# Altium schematic sheet Kontroler.SchDoc
size A2; SheetNumber: 1; SheetTotal: 1
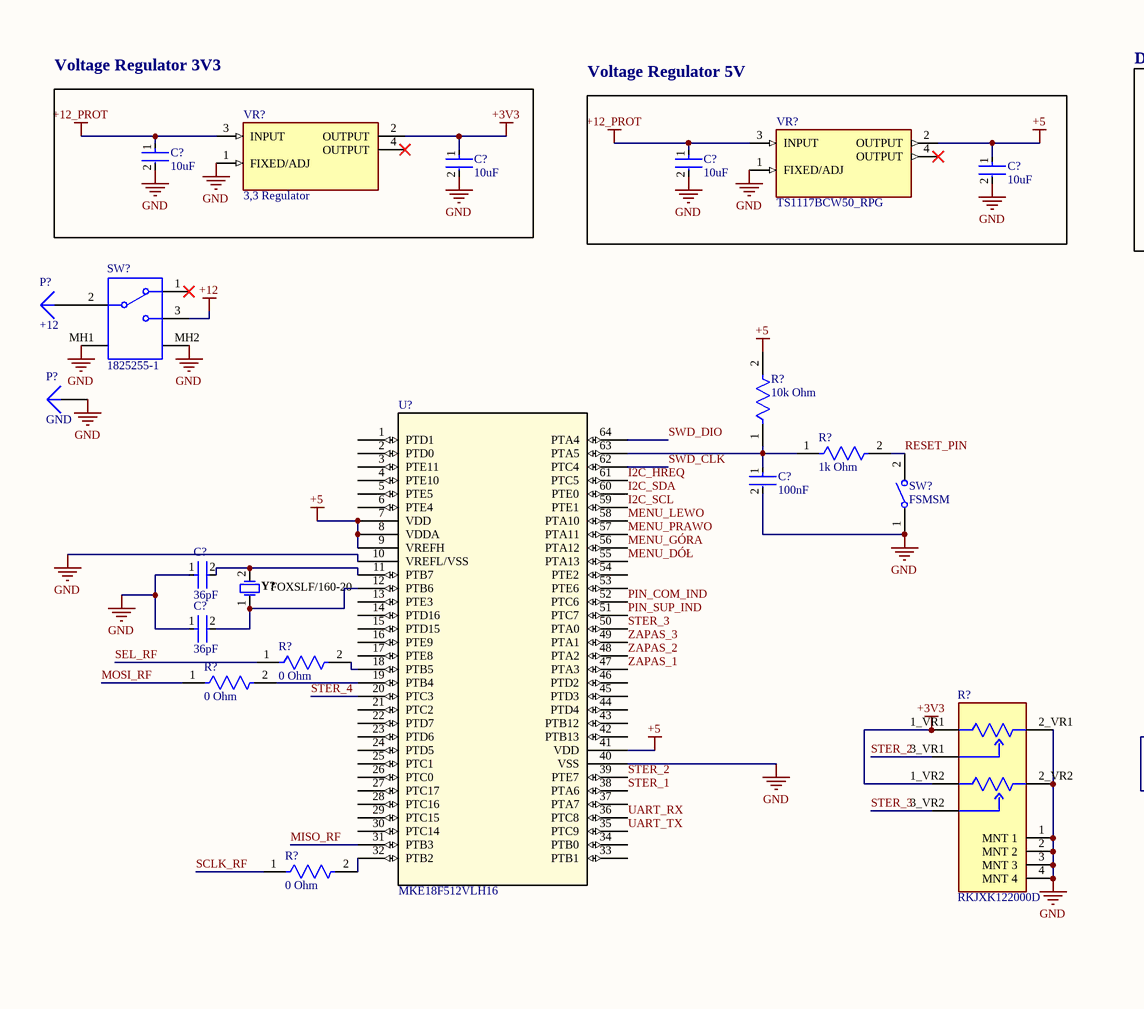
[diagram p0: Kontroler.SchDoc, left]
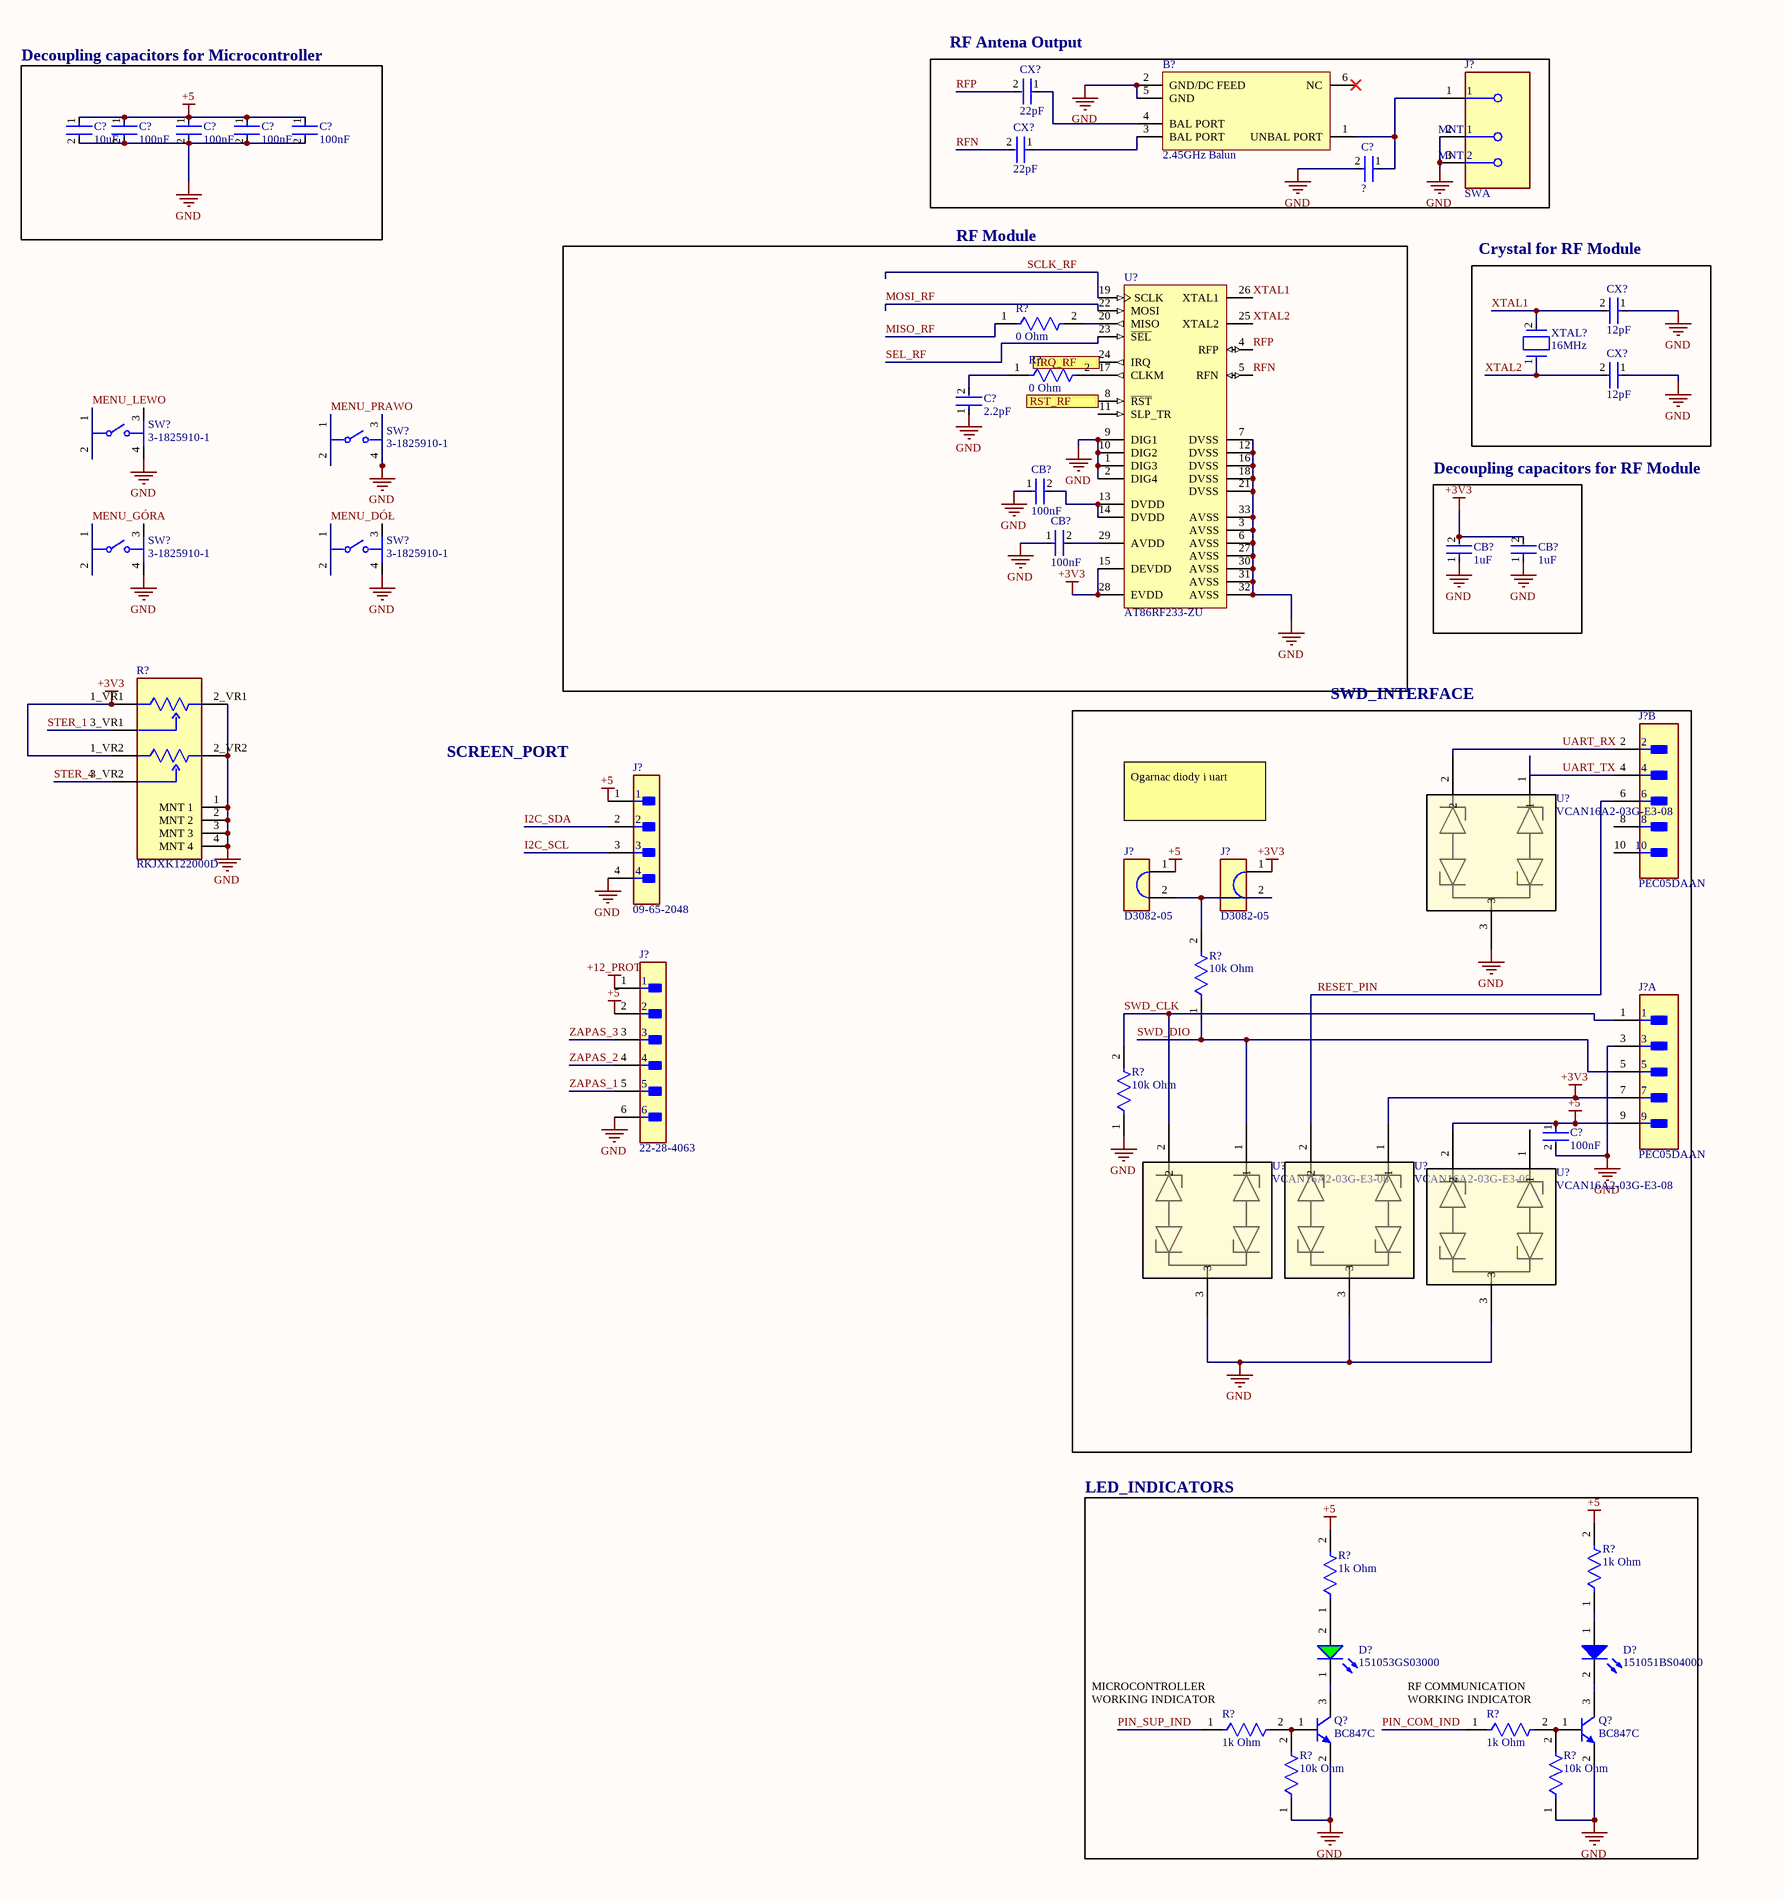
[diagram p1: Kontroler.SchDoc, right]

## Parts
(Parts that share a designator on the sheet are numbered #1, #2 ... from top to bottom, then left to right.)
B?  2.45GHz Balun  [WE-BAL_0805]
C?#1  10uF  [FP-CC0805-0_85-MFG]
C?#2  100nF  [FP-CC0805-0_85-MFG]
C?#3  100nF  [FP-CC0805-0_85-MFG]
C?#4  100nF  [FP-CC0805-0_85-MFG]
C?#5  100nF  [FP-CC0805-0_85-MFG]
C?#6  10uF  [FP-CC0805-0_85-MFG]
C?#7  10uF  [FP-CC0805-0_85-MFG]
C?#8  10uF  [FP-CC0805-0_85-MFG]
C?#9  10uF  [FP-CC0805-0_85-MFG]
C?#10  ?  [FP-CC0805-0_85-MFG]
C?#11  2.2pF  [FP-CC0805-0_85-MFG]
C?#12  100nF  [FP-CC0805-0_85-MFG]
C?#13  36pF  [FP-CC0805-0_85-MFG]
C?#14  36pF  [FP-CC0805-0_85-MFG]
C?#15  100nF  [FP-CC0805-0_85-MFG]
CB?#1  100nF  [FP-CC0805-0_85-MFG]
CB?#2  100nF  [FP-CC0805-0_85-MFG]
CB?#3  1uF  [FP-CC0805-0_85-MFG]
CB?#4  1uF  [FP-CC0805-0_85-MFG]
CX?#1  22pF  [FP-CC0805-0_85-MFG]
CX?#2  22pF  [FP-CC0805-0_85-MFG]
CX?#3  12pF  [FP-CC0805-0_85-MFG]
CX?#4  12pF  [FP-CC0805-0_85-MFG]
D?#1  151053GS03000  [WL-TMRW_D5.8H11.7]
D?#2  151051BS04000  [WL-TMRC_D5.9H8.7]
J?#1  SWA  [FP-142-0701-801-MFG]
J?#2  PEC05DAAN  [FP-PEC05DAAN-MFG]  (part B of 2)
J?#3  09-65-2048  [FP-09-65-2048-MFG]
J?#4  D3082-05  [FP-D3082-05-MFG]
J?#5  D3082-05  [FP-D3082-05-MFG]
J?#6  22-28-4063  [FP-22-28-4063-MFG]
J?#7  PEC05DAAN  [FP-PEC05DAAN-MFG]  (part A of 2)
P?#1  +12  [PIN1]
P?#2  GND  [PIN1]
Q?#1  BC847C  [INF-SOT23_L]
Q?#2  BC847C  [INF-SOT23_L]
R?#1  0 Ohm  [FP-RMCF0805-MFG]
R?#2  0 Ohm  [FP-RMCF0805-MFG]
R?#3  10k Ohm  [FP-RMCF0805-MFG]
R?#4  1k Ohm  [FP-RMCF0805-MFG]
R?#5  0 Ohm  [FP-RMCF0805-MFG]
R?#6  0 Ohm  [FP-RMCF0805-MFG]
R?#7  RKJXK122000D  [FP-RKJXK122000D-MFG]
R?#8  RKJXK122000D  [FP-RKJXK122000D-MFG]
R?#9  0 Ohm  [FP-RMCF0805-MFG]
R?#10  10k Ohm  [FP-RMCF0805-MFG]
R?#11  10k Ohm  [FP-RMCF0805-MFG]
R?#12  1k Ohm  [FP-RMCF0805-MFG]
R?#13  1k Ohm  [FP-RMCF0805-MFG]
R?#14  1k Ohm  [FP-RMCF0805-MFG]
R?#15  1k Ohm  [FP-RMCF0805-MFG]
R?#16  10k Ohm  [FP-RMCF0805-MFG]
R?#17  10k Ohm  [FP-RMCF0805-MFG]
SW?#1  1825255-1  [TECO-1825255-1_V]
SW?#2  3-1825910-1  [FP-3-1825910-1-MFG]
SW?#3  3-1825910-1  [FP-3-1825910-1-MFG]
SW?#4  FSMSM  [TECO-FSMSM-2_V]
SW?#5  3-1825910-1  [FP-3-1825910-1-MFG]
SW?#6  3-1825910-1  [FP-3-1825910-1-MFG]
U?#1  AT86RF233-ZU  [32QN2_M]
U?#2  MKE18F512VLH16  [LQFP64-10x10_NXP]
U?#3  VCAN16A2-03G-E3-08  [SOT_3G-E3-08_VIS]
U?#4  VCAN16A2-03G-E3-08  [SOT_3G-E3-08_VIS]
U?#5  VCAN16A2-03G-E3-08  [SOT_3G-E3-08_VIS]
U?#6  VCAN16A2-03G-E3-08  [SOT_3G-E3-08_VIS]
VR?#1  3,3 Regulator  [VREG_TS1117BCW33_RPG]
VR?#2  TS1117BCW50_RPG  [VREG_TS1117BCW50_RPG]
XTAL?  16MHz  [FP-ABLS-MFG]
Y?  FOXSLF/160-20  [FOX-FOXSLF160-20]

## Blocks framed on the sheet
Decoupling capacitors for Microcontroller: C?#1-C?#5
RF Module: C?#11 CB?#1 CB?#2 R?#1 R?#2 U?#1
Crystal for RF Module: CX?#3 CX?#4 XTAL?
Decoupling capacitors for RF Module: CB?#3 CB?#4
SWD_INTERFACE: C?#15 J?#2 J?#4 J?#5 J?#7 R?#10 R?#11 U?#3-U?#6
LED_INDICATORS: D?#1 D?#2 Q?#1 Q?#2 R?#12-R?#17

## Ports
IRQ_RF (out), RST_RF (in)

## Nets
+3V3: C?#7.1 CB?#3.2 CB?#4.2 J?#5.1 J?#7.7 R?#7.1_VR1(1_VR1) R?#7.1_VR2(1_VR2) R?#8.1_VR1(1_VR1) R?#8.1_VR2(1_VR2) U?#1.15(DEVDD) U?#1.28(EVDD) U?#5.1 VR?#1.2(OUTPUT)
+5: C?#1.1 C?#2.1 C?#3.1 C?#4.1 C?#5.1 C?#9.1 C?#15.1 J?#3.1 J?#4.1 J?#6.2 J?#7.9 R?#3.2 R?#12.2 R?#13.2 U?#2.7(VDD) U?#2.8(VDDA) U?#2.9(VREFH) U?#2.41(VDD) U?#6.2 VR?#2.2(OUTPUT)
+12: SW?#1.3
+12_PROT: C?#6.1 C?#8.1 J?#6.1 VR?#1.3(INPUT) VR?#2.3(INPUT)
GND: B?.2(GND/DC_FEED) B?.5(GND) C?#1.2 C?#2.2 C?#3.2 C?#4.2 C?#5.2 C?#6.2 C?#7.2 C?#8.2 C?#9.2 C?#10.2 C?#11.1 C?#12.2 C?#13.1 C?#14.1 C?#15.2 CB?#1.1 CB?#2.1 CB?#3.1 CB?#4.1 CX?#3.1 CX?#4.1 J?#1.2(MNT_1) J?#1.3(MNT_2) J?#3.4 J?#6.6 J?#7.3 P?#2.1 Q?#1.2(E) Q?#2.2(E) R?#7.1(MNT_1) R?#7.2(MNT_2) R?#7.2_VR1(2_VR1) R?#7.2_VR2(2_VR2) R?#7.3(MNT_3) R?#7.4(MNT_4) R?#8.1(MNT_1) R?#8.2(MNT_2) R?#8.2_VR1(2_VR1) R?#8.2_VR2(2_VR2) R?#8.3(MNT_3) R?#8.4(MNT_4) R?#11.1 R?#16.1 R?#17.1 SW?#1.MH1 SW?#1.MH2 SW?#2.4 SW?#3.3 SW?#3.4 SW?#4.1 SW?#5.4 SW?#6.4 U?#1.1(DIG3) U?#1.2(DIG4) U?#1.3(AVSS) U?#1.6(AVSS) U?#1.7(DVSS) U?#1.9(DIG1) U?#1.10(DIG2) U?#1.12(DVSS) U?#1.16(DVSS) U?#1.18(DVSS) U?#1.21(DVSS) U?#1.27(AVSS) U?#1.30(AVSS) U?#1.31(AVSS) U?#1.32(AVSS) U?#1.33(AVSS) U?#2.10(VREFL/VSS) U?#2.40(VSS) U?#3.3 U?#4.3 U?#5.3 U?#6.3 VR?#1.1(FIXED/ADJ) VR?#2.1(FIXED/ADJ)
I2C_HREQ: U?#2.61(PTC5)
I2C_SCL: J?#3.3 U?#2.59(PTE1)
I2C_SDA: J?#3.2 U?#2.60(PTE0)
MENU_DÓŁ: SW?#6.1 SW?#6.2 U?#2.55(PTA13)
MENU_GÓRA: SW?#5.1 SW?#5.2 U?#2.56(PTA12)
MENU_LEWO: SW?#2.1 SW?#2.2 U?#2.58(PTA10)
MENU_PRAWO: SW?#3.1 SW?#3.2 U?#2.57(PTA11)
MISO_RF: R?#1.1 U?#2.31(PTB3)
MOSI_RF: R?#6.1 U?#1.22(MOSI)
PIN_COM_IND: R?#15.1 U?#2.52(PTC6)
PIN_SUP_IND: R?#14.1 U?#2.51(PTC7)
RESET_PIN: J?#2.6 R?#4.2 SW?#4.2 U?#5.2
RFN: CX?#2.2 U?#1.5(RFN)
RFP: CX?#1.2 U?#1.4(RFP)
RST_RF: U?#1.8(~{RST}) ; port RST_RF
SCLK_RF: R?#9.1 U?#1.19(SCLK)
SEL_RF: R?#5.1 U?#1.23(~{SEL})
STER_1: R?#8.3_VR1(3_VR1) U?#2.38(PTA6)
STER_2: R?#7.3_VR1(3_VR1) U?#2.39(PTE7)
STER_3: R?#7.3_VR2(3_VR2) U?#2.50(PTA0)
STER_4: R?#8.3_VR2(3_VR2) U?#2.20(PTC3)
SWD_CLK: J?#7.1 R?#11.2 U?#2.62(PTC4) U?#4.2
SWD_DIO: J?#7.5 R?#10.1 U?#2.64(PTA4) U?#4.1
UART_RX: J?#2.2 U?#2.36(PTC8) U?#3.2
UART_TX: J?#2.4 U?#2.35(PTC9) U?#3.1
XTAL1: CX?#3.2 U?#1.26(XTAL1) XTAL?.2
XTAL2: CX?#4.2 U?#1.25(XTAL2) XTAL?.1
ZAPAS_1: J?#6.5 U?#2.47(PTA3)
ZAPAS_2: J?#6.4 U?#2.48(PTA2)
ZAPAS_3: J?#6.3 U?#2.49(PTA1)
NetB?_1: B?.1(UNBAL_PORT) C?#10.1 J?#1.1
NetB?_3: B?.3(BAL_PORT) CX?#2.1
NetB?_4: B?.4(BAL_PORT) CX?#1.1
NetC?#11_2: C?#11.2 R?#2.1
NetC?#12_1: C?#12.1 R?#3.1 R?#4.1 U?#2.63(PTA5)
NetC?#13_2: C?#13.2 U?#2.11(PTB7) Y?.2
NetC?#14_2: C?#14.2 U?#2.12(PTB6) Y?.1
NetCB?#1_2: CB?#1.2 U?#1.13(DVDD) U?#1.14(DVDD)
NetCB?#2_2: CB?#2.2 U?#1.29(AVDD)
NetD?#1_1: D?#1.1(K) Q?#1.3(C)
NetD?#1_2: D?#1.2(A) R?#13.1
NetD?#2_1: D?#2.1(A) R?#12.1
NetD?#2_2: D?#2.2(K) Q?#2.3(C)
NetJ?#4_2: J?#4.2 J?#5.2 R?#10.2
NetP?#1_1: P?#1.1 SW?#1.2
NetQ?#1_1: Q?#1.1(B) R?#14.2 R?#16.2
NetQ?#2_1: Q?#2.1(B) R?#15.2 R?#17.2
NetR?#1_2: R?#1.2 U?#1.20(MISO)
NetR?#2_2: R?#2.2 U?#1.17(CLKM)
NetR?#5_2: R?#5.2 U?#2.18(PTB5)
NetR?#6_2: R?#6.2 U?#2.19(PTB4)
NetR?#9_2: R?#9.2 U?#2.32(PTB2)

Not connected (* = marked no-connect by the designer): B? 6(NC)*; J?#2 8 10; SW?#1 1*; SW?#2 3; SW?#5 3; SW?#6 3; U?#1 11(SLP_TR) 24(IRQ); U?#2 1(PTD1) 2(PTD0) 3(PTE11) 4(PTE10) 5(PTE5) 6(PTE4) 13(PTE3) 14(PTD16) 15(PTD15) 16(PTE9) 17(PTE8) 21(PTC2) 22(PTD7) 23(PTD6) 24(PTD5) 25(PTC1) 26(PTC0) 27(PTC17) 28(PTC16) 29(PTC15) 30(PTC14) 33(PTB1) 34(PTB0) 37(PTA7) 42(PTB13) 43(PTB12) 44(PTD4) 45(PTD3) 46(PTD2) 53(PTE6) 54(PTE2); U?#6 1; VR?#1 4(OUTPUT)*; VR?#2 4(OUTPUT)*

## Notes on the sheet
- (near CX?#1) RF Antena Output
- Voltage Regulator 3V3
- Voltage Regulator 5V
- SCREEN_PORT
- Ogarnac diody i uart
- (near R?#14) MICROCONTROLLER WORKING INDICATOR
- (near R?#15) RF COMMUNICATION WORKING INDICATOR

## Library data of the parts
B? = CMP-03913-19122360-1: 748421245 100O Surface Mount Chip Balun; Insertion Loss (dB): 0.54dB; Impedance: 100Ω; Frequency: 2.5GHz; Depth: 850µm; Case Code (Metric): 2012; Height: 850µm; Max Operating Temperature: 85°C; Length: 2mm; Width: 1.25mm; Termination: SMD/SMT; Case Code (Imperial): 0805; Number of Pins: 6; RoHS: Compliant; Max Switching Frequency: 2.5GHz; NexarPartId: 19122360; REACH SVHC: Unknown; Case/Package: 0805; Min Operating Temperature: -40°C; Lead Free: Lead Free; Mount: Surface Mount; Max Frequency: 2.5GHz; Packaging: Cut Tape (CT)
C?#1 C?#6-C?#11 C?#13 C?#14 = CMP-2100-03606-3: CAP CER 0.1UF 50V X7R 0805; Manufacturer Part Number: CC0805KRX7R9BB104; Manufacturer: Yageo; Tolerance: 0.1; Capacitance: 100 nF; Value: 100 nF; Material: Ceramic; Device Class L1: Passive Components; ComponentLink2Description: Datasheet; Package: CC0805-0.85; Digikey Description: CAP CER 0.1UF 50V X7R 0805; Device Class L3: Ceramic Capacitors; Temperature: -30°C to +85°C; Temperature Characteristic: X7R; Voltage Rating: 50 V; Height: 0.95mm; RoHS: TRUE; Ipc Land Pattern Name: CAPC200125X85; Device Class L2: Capacitors; Category: Cap; Temperature Range Low: -30°C; Temperature Range High: +85°C; Mouser Description: Multilayer Ceramic Capacitors MLCC - SMD/SMT 100nF 50V X7R 10%; Footprint Url: http://www.yageo.com/exep/pages/download/literatures/UPY-C_GEN_24.pdf; Automotive: No; Octopart: https://octopart.com/cc0805krx7r9bb104-yageo-192993; Lead Free: Yes; ComponentLink2URL: http://www.yageo.com/documents/recent/UPY-GPHC_Y5V_6.3V-to-50V_8.pdf
C?#2-C?#5 C?#12 C?#15 = CMP-2100-03606-3: CAP CER 0.1UF 50V X7R 0805; Manufacturer Part Number: CC0805KRX7R9BB104; Manufacturer: Yageo; Tolerance: 0.1; Material: Ceramic; Device Class L1: Passive Components; ComponentLink2Description: Datasheet; Package: CC0805-0.85; Digikey Description: CAP CER 0.1UF 50V X7R 0805; Capacitance: 100 nF; Device Class L3: Ceramic Capacitors; Value: 100 nF; Temperature: -30°C to +85°C; Temperature Characteristic: X7R; Voltage Rating: 50 V; Height: 0.95mm; RoHS: TRUE; Ipc Land Pattern Name: CAPC200125X85; Device Class L2: Capacitors; Category: Cap; Temperature Range Low: -30°C; Temperature Range High: +85°C; Mouser Description: Multilayer Ceramic Capacitors MLCC - SMD/SMT 100nF 50V X7R 10%; Footprint Url: http://www.yageo.com/exep/pages/download/literatures/UPY-C_GEN_24.pdf; Automotive: No; Octopart: https://octopart.com/cc0805krx7r9bb104-yageo-192993; Lead Free: Yes; ComponentLink2URL: http://www.yageo.com/documents/recent/UPY-GPHC_Y5V_6.3V-to-50V_8.pdf
CB?#1 CB?#2 = CMP-2100-03606-3: CAP CER 0.1UF 50V X7R 0805; Manufacturer Part Number: CC0805KRX7R9BB104; Manufacturer: Yageo; Tolerance: 0.1; Device Class L1: Passive Components; ComponentLink2Description: Datasheet; Package: CC0805-0.85; Digikey Description: CAP CER 0.1UF 50V X7R 0805; Capacitance: 100 nF; Device Class L3: Ceramic Capacitors; Value: 100 nF; Temperature: -30°C to +85°C; Temperature Characteristic: X7R; Voltage Rating: 50 V; Height: 0.95mm; RoHS: TRUE; Ipc Land Pattern Name: CAPC200125X85; Device Class L2: Capacitors; Category: Cap; Temperature Range Low: -30°C; Temperature Range High: +85°C; Material: Ceramic; Mouser Description: Multilayer Ceramic Capacitors MLCC - SMD/SMT 100nF 50V X7R 10%; Footprint Url: http://www.yageo.com/exep/pages/download/literatures/UPY-C_GEN_24.pdf; Automotive: No; Octopart: https://octopart.com/cc0805krx7r9bb104-yageo-192993; Lead Free: Yes; ComponentLink2URL: http://www.yageo.com/documents/recent/UPY-GPHC_Y5V_6.3V-to-50V_8.pdf
CB?#3 CB?#4 CX?#1-CX?#4 = CMP-2100-03606-3: CAP CER 0.1UF 50V X7R 0805; Manufacturer Part Number: CC0805KRX7R9BB104; Manufacturer: Yageo; Tolerance: 0.1; Capacitance: 100 nF; Value: 100 nF; Device Class L1: Passive Components; ComponentLink2Description: Datasheet; Package: CC0805-0.85; Digikey Description: CAP CER 0.1UF 50V X7R 0805; Device Class L3: Ceramic Capacitors; Temperature: -30°C to +85°C; Temperature Characteristic: X7R; Voltage Rating: 50 V; Height: 0.95mm; RoHS: TRUE; Ipc Land Pattern Name: CAPC200125X85; Device Class L2: Capacitors; Category: Cap; Temperature Range Low: -30°C; Temperature Range High: +85°C; Material: Ceramic; Mouser Description: Multilayer Ceramic Capacitors MLCC - SMD/SMT 100nF 50V X7R 10%; Footprint Url: http://www.yageo.com/exep/pages/download/literatures/UPY-C_GEN_24.pdf; Automotive: No; Octopart: https://octopart.com/cc0805krx7r9bb104-yageo-192993; Lead Free: Yes; ComponentLink2URL: http://www.yageo.com/documents/recent/UPY-GPHC_Y5V_6.3V-to-50V_8.pdf
D?#1 = CMP-1489-00005-2: NexarPartId: 29717817; Viewing Angle: 30°; Color: Green; Wavelength: 522nm; Max Reverse Voltage (DC): 5V; Test Current: 20mA; Forward Current: 100mA; Forward Voltage: 3.4V; Lens Style: Circular, Clear, Round; Luminous Intensity: 10cd; Lens Size: 5mm; Peak Wavelength: 515nm; Length: 5mm; Min Operating Temperature: -40°C; Case/Package: Radial; REACH SVHC: Unknown; Height: 8.6mm; Mount: Through Hole; Dominant Wavelength: 522nm; Max Operating Temperature: 85°C; Width: 5mm; Packaging: Bulk; RoHS: Compliant
D?#2 = CMP-1488-00009-2: NexarPartId: 29717812; Test Current: 20mA; Forward Voltage: 3.2V; Wavelength: 470nm; Lens Size: 5mm; Lens Style: Circular, Diffused, Round; Forward Current: 100mA; Peak Wavelength: 465nm; Viewing Angle: 40°; Luminous Intensity: 500mcd; Max Reverse Voltage (DC): 5V; Color: Blue; Case/Package: Radial; Width: 5mm; Mount: Through Hole; Min Operating Temperature: -40°C; Length: 5mm; Height: 8.6mm; Max Operating Temperature: 85°C; Packaging: Bulk; RoHS: Compliant; REACH SVHC: Unknown; Dominant Wavelength: 470nm
J?#1 = CMP-09588-000002-1: Frequency: 18GHz; Operating Frequency: 0 to 18 GHz; Body Material: Brass; Impedance: 50R; Connector Type: SMA; Voltage Rating: 335V; Gender: Female; Body Plating: Gold; Orientation: Straight; Length: 0.44inch; Max Operating Temperature: 165°C; Package Quantity: 5; Packaging: Bulk; Series: SMA; Contact Material: Copper; Min Operating Temperature: -65°C; Depth: 25.58mm; RoHS Compliant: Yes; Case/Package: SMA; Max Frequency: 18GHz; Radiation Hardening: No; Contact Plating: Gold; Mount: Edge; Fastening Type: Threaded; Termination: Solder
J?#2 J?#7 = CMP-25680-000034-1: CONN HEADER VERT 10POS 2.54MM; Pitch: 0.1inch; Number of Positions: 10; Gender: Male; Connector Type: Male Pin; Contact Type: Male Pin; Height: 2.54mm; Termination: Solder; Packaging: Bulk; Housing Material: Plastic; Contact Mating Length: 0.23inch; Width: 5.08mm; Row Spacing: 0.1inch; Housing Color: Black; Mount: Through Hole; Contact Plating: Tin; Contact Material: Bronze; Color: Black; Package Quantity: 1; Length: 12.7mm; Lead Free: Lead Free; Number of Rows: 2; Number of Contacts: 10
J?#3 = CMP-04776-000474-1: CONN HEADER VERT 4POS 3.96MM; Glow Wire Compliant: Non-compliant; Current Rating: 7A; Max Current Rating: 3A; Number of Contacts: 4; Insulation Resistance: 1GR; Voltage Rating (DC): 250V; Contact Resistance: 10mR; Gender: Male; Length: 12.88mm; Packaging: Bulk; Flammability Rating: UL94 V-2; RoHS Compliant: Yes; Housing Material: Nylon; Pitch: 3.96mm; Contact Gender: Male; Orientation: Straight; Housing Color: Natural; Min Operating Temperature: -40°C; Series: 5273; Lead Free: Lead Free; Package Quantity: 6000; Max Voltage Rating (AC): 250V; Radiation Hardening: No; Termination: Through Hole; Depth: 2.29mm; Contact Material: Brass; Number of Positions: 4; Height: 2.03mm; Contact Plating: Tin; Number of Rows: 1; Mount: Through Hole; Voltage Rating: 250V; Max Operating Temperature: 105°C
J?#4 J?#5 = CMP-15817-000014-1: 1MM UNINSULATED SHORTING PLUG; Number of Contacts: 2; Body Length: 9mm; Current Rating: 10A; Insulation: Non-Insulated; Plating: Gold; Pitch: 10.16mm; Gender: Male; Hole Diameter: 1.05mm; Length: 9mm; RoHS Compliant: Yes; Orientation: Straight; Number of Rows: 1; Package Quantity: 2000; Max Current Rating: 10A; Material: Brass; Insulation Material: PBT; Series: D308; Height: 0.359inch; Mount: Through Hole; Contact Material: Brass; Number of Positions: 2; Packaging: Bulk; REACH SVHC: No SVHC; Contact Plating: Gold; Depth: 1mm; Color: Black
J?#6 = CMP-04776-000885-1: CONN HEADER VERT 6POS 2.54MM; Number of Circuits: 6; Voltage Rating (DC): 250V; Connector Type: Male Pin; Contact Resistance: 20mR; Glow Wire Compliant: Non-compliant; Gender: Male; Current Rating: 4A; Max Voltage Rating (DC): 250.25kV; Series: KK® 42375; Termination: Solder; Orientation: Straight; Max Operating Temperature: 75°C; Min Operating Temperature: 0°C; Mount: Through Hole; Depth: 2.49mm; Contact Material: Brass; Number of Positions: 6; Contact Mating Length: 0.24inch; Number of Rows: 1; Housing Color: Black; Max Voltage Rating (AC): 250V; Housing Material: Thermoplastic; Packaging: Bulk; Contact Plating: Gold; Contact Type: Male Pin; Package Quantity: 1; Number of Contacts: 6; Voltage Rating: 250V; Lead Free: Lead Free; RoHS Compliant: Yes; Pitch: 2.54mm; Color: Black; Flammability Rating: UL94 V-0; Radiation Hardening: No
P?#1 P?#2 = Plug: LatestRevisionDate: 17-Jul-2002; LatestRevisionNote: Re-released for DXP Platform.; Publisher: Altium Limited
Q?#1 Q?#2 = CMP-1177-00037-1: NPN Silicon AF Transistor, 45 V VCEO, 100 mA IC, SOT23, Reel, Green; Manufacturer: Infineon; VCEO (max): 45Â V; VEBO (max): 6Â V; fT (typ): 250Â MHz; VCBO (max): 50Â V; ICM (max): 200Â mA; Green: TRUE; IC (max): 100Â mA; Ptot (max): 330Â mW; ICBO (max): 15Â nA; PartNumber: BC847C; ComponentLink3URL: http://www.infineon.com/dgdl/SOT23-Package_Overview.pdf?folderId=db3a30431936bc4b0119532290053c66&fileId=db3a30431936bc4b0119533468123c85; ComponentLink3Description: Package Specification; Mounting Technology: Surface Mount; PackageDescription: 3-Pin Small Outline Transistor Package, 1.3 x 2.9 mm Body, 0.95 mm Pitch; PackageReference: SOT23; ComponentLink2URL: http://www.infineon.com/dgdl/bc847series_bc848series_bc849series_bc850series.pdf?folderId=db3a304314dca389011541d30fa21656&fileId=db3a304314dca389011541d4630a1657; ComponentLink2Description: Datasheet; ComponentLink1Description: Manufacturer URL; Polarity: NPN; ComponentLink1URL: http://www.infineon.com/; IBM (max): 200Â mA; Packing: Reel; PackageVersion: Apr-08
R?#1-R?#6 R?#9-R?#17 = CMP-26527-000017-1: RES 0 OHM JUMPER 1/8W 0805; Power Rating: 125mW; Resistance: 0mR; Depth: 1.25mm; Length: 2mm; Military Standard: Not; Width: 0.049inch; Case Code (Imperial): 0805; Number of Terminations: 2; Mount: Surface Mount; Contact Plating: Tin; Height: 0.026inch; Case/Package: 0805; Min Operating Temperature: -55°C; Composition: Thick Film; Max Operating Temperature: 155°C; Packaging: Tape and Reel; Features: Automotive AEC-Q200; Max Power Dissipation: 125mW; Radiation Hardening: No; Lead Free: Lead Free; Case Code (Metric): 2012
R?#7 R?#8 = CMP-24118-000003-1: ALPS NAVIGATION SWITCH, RESISTIVE, PCB; Life (Hours): 100Hour; Operating Force: 5.2N; Resistance: 10kR; Insulation Resistance: 100MR; Power Rating: 12.5mW; Current Rating: 50mA; Lead Free: Lead Free; Mount: Through Hole; Resistor Type: Potentiometer; Min Operating Temperature: -10°C; Series: RKJXV/ RKJXK; Military Standard: Not; Width: 16mm; Length: 16mm; Max Operating Temperature: 70°C; Package Quantity: 10; Height: 12.9mm; Type: Potentiometer; Packaging: Tray; Radiation Hardening: No; Termination: Pin; RoHS Compliant: Yes; Depth: 20.7mm
SW?#1 = CMP-2100-03576-1: Slide Switch, SPDT, 125 V, -20 to 85 degC, 5-Pin THD, RoHS, Tray; Manufacturer: TE Connectivity; Electrical Life: 15000Cycles; Number of Positions: 2; Operating Force: 600gf; Max Voltage Rating (AC): 125V; Actuator Length: 4.5mm; Current Rating: 300mA; Contact Style: Shorting; Switch Travel: 4mm; Flammability Rating: UL94HB; Termination: PCPins; Package Quantity: 560; Throw Configuration: SPDT; Datasheet Version: Rev. A4, 03/2014; Mount: ThroughHole; Package Reference: 1825255-1; Case/Package: 300; Depth: 6.7mm; Packaging: Bulk; Package Description: 5-Pin Through Hole Device, Body 6.7 x 16 mm, Pitch 4 mm; REACH SVHC: Unknown; ELV: Compliant; Voltage Rating (AC): 125V; Max Current Rating: 300mA; Radiation Hardening: No; Min Operating Temperature: -20degC; Contact Plating: Silver; Length: 16mm; Manufacturer URL: http://www.te.com/; Orientation: Vertical; Contact Material: Copper; RoHSCompliant: true; Lead Free: LeadFree; Max Operating Temperature: 85degC; Datasheet URL: http://www.te.com/commerce/DocumentDelivery/DDEController?Action=showdoc&DocId=Customer+Drawing%7F1825255%7FA4%7Fpdf%7FEnglish%7FENG_CD_1825255_A4_baseFilename.pdf%7F1825255-1
SW?#2 SW?#3 SW?#5 SW?#6 = CMP-03407-000001-1: SWITCH TACTILE SPST-NO 0.05A 24V; Manufacturer: TE Connectivity; Operating Force: 160gf; Contact Current Rating: 50mA; Contact Resistance: 100mΩ; Electromechanical Life: 100000Cycles; Device Class L1: Electromechanical; ComponentLink2URL: https://www.te.com/commerce/DocumentDelivery/DDEController?Action=srchrtrv&DocNm=1825910&DocType=Customer+Drawing&DocLang=English; Category: Switch; Device Class L2: Switches; Temperature: -35°C to +85°C; RoHS: TRUE; Mount: Through Hole; Manufacturer Part Number: 3-1825910-1; Automotive: No; Lead Free: Yes; Device Class L3: Tactile Switches; ComponentLink2Description: Datasheet; Temperature Range High: +85°C; Height: 17.3mm; Package: 0; Temperature Range Low: -35°C; Throw Configuration: SPST-NO; Digikey Description: SWITCH TACTILE SPST-NO 0.05A 24V; Octopart: https://octopart.com/3-1825910-1-te+connectivity-46506874
SW?#4 = CMP-2000-07511-1: FSMSM Push Button Switch, 50 mA, -35 to 85 degC, 2-Pin SMD, RoHS, Bulk; Manufacturer: TE Connectivity; Actuator Length: 1.07mm; Electrical Life: 20000Cycles; Actuator Material: Polyamide; Current Rating: 50mA; Illumination Type: Illuminated; Voltage Rating (DC): 24V; Contact Resistance: 100mOhm; Case\/Package: SMD/SMT; Operating Force: 180gf; Switch Travel: 0.25mm; Max Voltage Rating (DC): 12V; Throw Configuration: SPST; Packaging: LoosePiece; Max Operating Temperature: 85degC; ELV: Compliant; Package Description: 2-Pin Surface Mount Device, Body 6 x 3.5 mm, Pitch 9.19 mm; RoHSCompliant: true; Manufacturer URL: http://www.te.com/; Contact Plating: Silver; Contact Material: Brass; Mounting Technology: SurfaceMount; Contact Current Rating: 50mA; Datasheet Version: Rev. C2, 08/2014; Datasheet URL: http://www.te.com/commerce/DocumentDelivery/DDEController?Action=showdoc&DocId=Customer+Drawing%7F1437566-3%7FC2%7Fpdf%7FEnglish%7FENG_CD_1437566-3_C2_1437566_3_1_c.dwg.pdf%7F1437566-3; Mechanical Life: 20000Cycles; Package Reference: FSMSM; REACH SVHC: Unknown; Orientation: Straight; Min Operating Temperature: -35degC; Lead Free: LeadFree; Termination: GullWing; Package Quantity: 1000; Mount: SurfaceMount
U?#1 = CMP-0295-00009-1: Low Power, 2.4GHz Transceiver for ZigBee, RF4CE, IEEE 802.15.4, 6LoWPAN, and ISM Application, 1.8 to 3.6 V, -40 to 85 degC, 32-Pin VQFN (QN2), RoHS, Tray; Manufacturer: Atmel; Frequency Band: 2445 MHz Typ.; Data Rate: 2 Mb/s Max.; Power Output: 4 dBm Typ.; PackageVersion: Rev. A; ComponentLink3URL: http://www.atmel.com/Images/Atmel-8351-MCU_Wireless-AT86RF233_Datasheet.pdf; Temperature Range: -40 to 85 degC; DatasheetVersion: Rev. 8315E; ComponentLink1Description: Manufacturer URL; ComponentLink2Description: Datasheet; ComponentLink3Description: Package Specification; Mounting Technology: Surface Mount; RoHS: TRUE; ComponentLink1URL: www.atmel.com/; PartNumber: AT86RF233-ZU; ComponentLink2URL: http://www.atmel.com/Images/Atmel-8351-MCU_Wireless-AT86RF233_Datasheet.pdf; Voltage Range: 1.8 to 3.6 V; PackageDescription: 32-Pin Quad Flat Non-Leaded Package, Body 5 x 5 mm, Pitch 0.5 mm; Packing: Tray
U?#2 = MKE18F512VLH16: No Description Available; Mfr_Name: NXP; RefDes: RefDes; Type: Type
U?#3-U?#6 = VCAN16A2-03G-E3-08: No Description Available; Mfr_Name: Vishay; RefDes: RefDes; Type: Type
VR?#1 = TS1117BCW33_RPG: MF: {'manufacturer': u'Taiwan Semiconductor'}; Package: None; Price: None; Value: *; MP: TS1117BCW33_RPG; Availability: Unavailable
XTAL? = CMP-27762-000003-1: CRYSTAL 16.0000MHZ 18PF SMD; Manufacturer Part Number: ABLS-16.000MHZ-K4T; Manufacturer: Abracon; Stability: 50ppm; Tolerance: 30ppm; Standoff Height: 0mm; Esr: 40Ω; ComponentLink2URL: https://abracon.com/Resonators/abls.pdf; Frequency: 16MHz; Temperature Range High: +125°C; Package: ABLS; Device Class L3: Crystals; Temperature: -40°C to +125°C; Load Capacitance: 18pF; Device Class L2: Crystals / Oscillators; Mouser Description: Crystal 16MHz ±30ppm (Tol) ±50ppm (Stability) 18pF FUND 40Ohm 2-Pin HC-49/US SMD T/R; Category: Crys; ComponentLink2Description: Datasheet; Series: ABLS; Automotive: No; Octopart: https://octopart.com/abls-16.000mhz-k4t-abracon-18618626; RoHS: TRUE; Digikey Description: CRYSTAL 16.0000MHZ 18PF SMD; Temperature Range Low: -40°C; Lead Free: Yes; Height: 4.3mm; Device Class L1: Passive Components
Y? = CMP-1749-00003-1: Resistance Weld Thru-Hole Crystal, 16 MHz, -20 to 70 degC, 2-Pin THD, RoHS, Bulk; Voltage Rating: 250 V; Tolerance: 1%; Resistance: 221 kohm; Case\Package: Axial; Power Rating: 250 mW; RoHSCompliant: true; Package Quantity: 200; Packaging: Bulk; Min Operating Temperature: -55 degC; DatasheetVersion: Mar-15; ComponentLink1URL: http://www.foxonline.com/; Max Operating Temperature: 155 degC; PackageReference: FOXSLF160-20; Mount: Through Hole; PackageDescription: 2-Pin Through Hole Device, Body 11.35 x 4.65 mm; ComponentLink1Description: Manufacturer URL; ComponentLink2URL: http://www.foxonline.com/pdfs/hc49slf.pdf; ComponentLink2Description: Datasheet; Length: 0.248 inch
VR?#2 = TS1117BCW50_RPG: Package: None; Price: None; Value: *; MP: TS1117BCW50_RPG; Availability: Unavailable